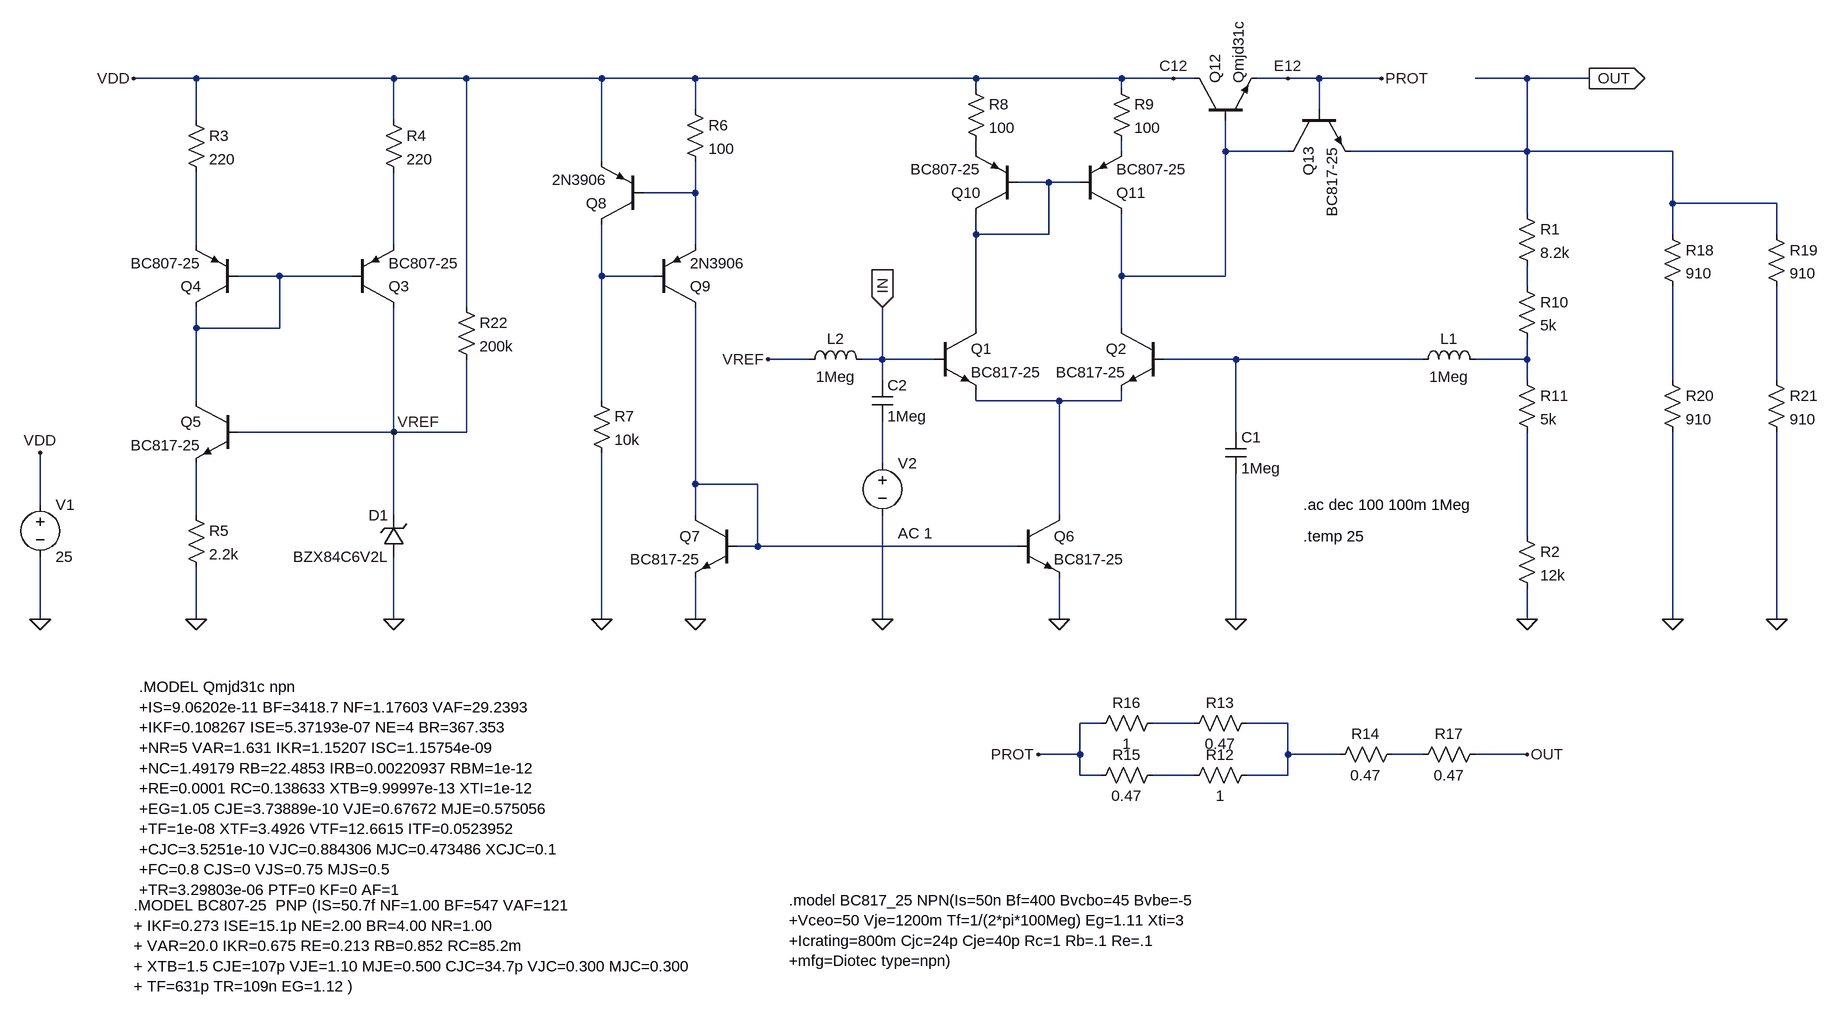
[diagram p0: schematic OPEN_LOOP.asc]
OPEN_LOOP.asc, the LTspice schematic file:
Version 4
SHEET 1 1412 880
WIRE -1088 -544 -1184 -544
WIRE -784 -544 -1088 -544
WIRE -672 -544 -784 -544
WIRE -464 -544 -672 -544
WIRE -320 -544 -464 -544
WIRE 112 -544 -320 -544
WIRE 336 -544 112 -544
WIRE 416 -544 336 -544
WIRE 448 -544 416 -544
WIRE 592 -544 544 -544
WIRE 640 -544 592 -544
WIRE 736 -544 640 -544
WIRE 960 -544 880 -544
WIRE 1056 -544 960 -544
WIRE 112 -528 112 -544
WIRE 336 -528 336 -544
WIRE -320 -496 -320 -544
WIRE 640 -496 640 -544
WIRE -1088 -480 -1088 -544
WIRE -784 -480 -784 -544
WIRE 112 -432 112 -448
WIRE 336 -432 336 -448
WIRE 496 -432 496 -480
WIRE 592 -432 496 -432
WIRE 960 -432 960 -544
WIRE 960 -432 688 -432
WIRE 1184 -432 960 -432
WIRE -464 -416 -464 -544
WIRE 224 -384 176 -384
WIRE 272 -384 224 -384
WIRE -320 -368 -320 -416
WIRE -320 -368 -400 -368
WIRE 1184 -352 1184 -432
WIRE 1344 -352 1184 -352
WIRE 960 -336 960 -432
WIRE 112 -304 112 -336
WIRE 224 -304 224 -384
WIRE 224 -304 112 -304
WIRE 1184 -304 1184 -352
WIRE 1344 -304 1344 -352
WIRE -1088 -288 -1088 -400
WIRE -784 -288 -784 -400
WIRE -320 -288 -320 -368
WIRE -960 -240 -1024 -240
WIRE -848 -240 -960 -240
WIRE -464 -240 -464 -320
WIRE -384 -240 -464 -240
WIRE 336 -240 336 -336
WIRE 496 -240 496 -432
WIRE 496 -240 336 -240
WIRE 960 -224 960 -256
WIRE -672 -192 -672 -544
WIRE -1088 -160 -1088 -192
WIRE -960 -160 -960 -240
WIRE -960 -160 -1088 -160
WIRE 112 -160 112 -304
WIRE 336 -160 336 -240
WIRE -144 -112 -208 -112
WIRE -32 -112 -32 -192
WIRE -32 -112 -64 -112
WIRE 48 -112 -32 -112
WIRE 512 -112 400 -112
WIRE 800 -112 512 -112
WIRE 960 -112 960 -144
WIRE 960 -112 880 -112
WIRE -32 -80 -32 -112
WIRE 960 -80 960 -112
WIRE 1184 -80 1184 -224
WIRE 1344 -80 1344 -224
WIRE -1088 -48 -1088 -160
WIRE -464 -48 -464 -240
WIRE 112 -48 112 -64
WIRE 240 -48 112 -48
WIRE 336 -48 336 -64
WIRE 336 -48 240 -48
WIRE -784 0 -784 -192
WIRE -784 0 -1024 0
WIRE -672 0 -672 -112
WIRE -672 0 -784 0
WIRE 512 0 512 -112
WIRE -32 48 -32 -16
WIRE -320 80 -320 -192
WIRE -224 80 -320 80
WIRE -1328 112 -1328 32
WIRE -1088 128 -1088 48
WIRE -784 128 -784 0
WIRE -320 128 -320 80
WIRE 240 128 240 -48
WIRE 960 160 960 0
WIRE -224 176 -224 80
WIRE -224 176 -256 176
WIRE 176 176 -224 176
WIRE -1328 288 -1328 192
WIRE -1088 288 -1088 208
WIRE -784 288 -784 192
WIRE -464 288 -464 32
WIRE -320 288 -320 224
WIRE -32 288 -32 128
WIRE 240 288 240 224
WIRE 512 288 512 64
WIRE 960 288 960 240
WIRE 1184 288 1184 0
WIRE 1344 288 1344 0
WIRE 304 448 272 448
WIRE 448 448 384 448
WIRE 592 448 528 448
WIRE 272 496 272 448
WIRE 272 496 208 496
WIRE 592 496 592 448
WIRE 672 496 592 496
WIRE 800 496 752 496
WIRE 960 496 880 496
WIRE 272 528 272 496
WIRE 304 528 272 528
WIRE 448 528 384 528
WIRE 592 528 592 496
WIRE 592 528 528 528
FLAG 960 288 0
FLAG -1088 288 0
FLAG 240 288 0
FLAG -320 288 0
FLAG -464 288 0
FLAG -208 -112 VREF
FLAG 1056 -544 OUT
IOPIN 1056 -544 Out
FLAG 416 -544 C12
FLAG 592 -544 E12
FLAG -1328 288 0
FLAG 736 -544 PROT
FLAG 208 496 PROT
FLAG 960 496 OUT
FLAG -1328 32 VDD
FLAG -1184 -544 VDD
FLAG -784 288 0
FLAG -784 0 VREF
FLAG 1184 288 0
FLAG 1344 288 0
FLAG 512 288 0
FLAG -32 288 0
FLAG -32 -192 IN
IOPIN -32 -192 In
SYMBOL npn 48 -160 R0
SYMATTR InstName Q1
SYMATTR Value BC817-25
SYMBOL npn 400 -160 M0
SYMATTR InstName Q2
SYMATTR Value BC817-25
SYMBOL res 944 -352 R0
SYMATTR InstName R1
SYMATTR Value 8.2k
SYMBOL res 944 144 R0
SYMATTR InstName R2
SYMATTR Value 12k
SYMBOL pnp -848 -192 M180
SYMATTR InstName Q3
SYMATTR Value BC807-25
SYMBOL pnp -1024 -192 R180
SYMATTR InstName Q4
SYMATTR Value BC807-25
SYMBOL npn -1024 -48 M0
SYMATTR InstName Q5
SYMATTR Value BC817-25
SYMBOL res -1104 -496 R0
SYMATTR InstName R3
SYMATTR Value 220
SYMBOL res -800 -496 R0
SYMATTR InstName R4
SYMATTR Value 220
SYMBOL res -1104 112 R0
SYMATTR InstName R5
SYMATTR Value 2.2k
SYMBOL npn 176 128 R0
SYMATTR InstName Q6
SYMATTR Value BC817-25
SYMBOL npn -256 128 M0
SYMATTR InstName Q7
SYMATTR Value BC817-25
SYMBOL pnp -400 -320 R180
SYMATTR InstName Q8
SYMATTR Value 2N3906
SYMBOL pnp -384 -192 M180
SYMATTR InstName Q9
SYMATTR Value 2N3906
SYMBOL res -336 -512 R0
SYMATTR InstName R6
SYMATTR Value 100
SYMBOL res -480 -64 R0
SYMATTR InstName R7
SYMATTR Value 10k
SYMBOL pnp 176 -336 R180
SYMATTR InstName Q10
SYMATTR Value BC807-25
SYMBOL pnp 272 -336 M180
SYMATTR InstName Q11
SYMATTR Value BC807-25
SYMBOL npn 448 -480 R270
SYMATTR InstName Q12
SYMATTR Value Qmjd31c
SYMBOL res 96 -544 R0
SYMATTR InstName R8
SYMATTR Value 100
SYMBOL res 320 -544 R0
SYMATTR InstName R9
SYMATTR Value 100
SYMBOL npn 592 -496 M90
SYMATTR InstName Q13
SYMATTR Value BC817-25
SYMBOL res 944 -240 R0
SYMATTR InstName R10
SYMATTR Value 5k
SYMBOL res 944 -96 R0
SYMATTR InstName R11
SYMATTR Value 5k
SYMBOL res 544 512 R90
WINDOW 0 0 56 VBottom 2
WINDOW 3 32 56 VTop 2
SYMATTR InstName R12
SYMATTR Value 1
SYMBOL res 544 432 R90
WINDOW 0 0 56 VBottom 2
WINDOW 3 32 56 VTop 2
SYMATTR InstName R13
SYMATTR Value 0.47
SYMBOL res 768 480 R90
WINDOW 0 0 56 VBottom 2
WINDOW 3 32 56 VTop 2
SYMATTR InstName R14
SYMATTR Value 0.47
SYMBOL res 400 512 R90
WINDOW 0 0 56 VBottom 2
WINDOW 3 32 56 VTop 2
SYMATTR InstName R15
SYMATTR Value 0.47
SYMBOL res 400 432 R90
WINDOW 0 0 56 VBottom 2
WINDOW 3 32 56 VTop 2
SYMATTR InstName R16
SYMATTR Value 1
SYMBOL res 896 480 R90
WINDOW 0 0 56 VBottom 2
WINDOW 3 32 56 VTop 2
SYMATTR InstName R17
SYMATTR Value 0.47
SYMBOL zener -768 192 R180
WINDOW 0 24 64 Left 2
WINDOW 3 24 0 Left 2
SYMATTR InstName D1
SYMATTR Value BZX84C6V2L
SYMBOL voltage -1328 96 R0
WINDOW 123 0 0 Left 0
WINDOW 39 0 0 Left 0
SYMATTR InstName V1
SYMATTR Value 25
SYMBOL res 1168 -320 R0
SYMATTR InstName R18
SYMATTR Value 910
SYMBOL res 1328 -320 R0
SYMATTR InstName R19
SYMATTR Value 910
SYMBOL res 1168 -96 R0
SYMATTR InstName R20
SYMATTR Value 910
SYMBOL res 1328 -96 R0
SYMATTR InstName R21
SYMATTR Value 910
SYMBOL res -688 -208 R0
SYMATTR InstName R22
SYMATTR Value 200k
SYMBOL ind 784 -96 R270
WINDOW 0 32 56 VTop 2
WINDOW 3 5 56 VBottom 2
SYMATTR InstName L1
SYMATTR Value 1Meg
SYMBOL cap 496 0 R0
SYMATTR InstName C1
SYMATTR Value 1Meg
SYMBOL cap -48 -80 R0
SYMATTR InstName C2
SYMATTR Value 1Meg
SYMBOL voltage -32 32 R0
WINDOW 123 24 124 Left 2
WINDOW 39 0 0 Left 0
SYMATTR Value2 AC 1
SYMATTR InstName V2
SYMATTR Value ""
SYMBOL ind -160 -96 R270
WINDOW 0 32 56 VTop 2
WINDOW 3 5 56 VBottom 2
SYMATTR InstName L2
SYMATTR Value 1Meg
TEXT -176 720 Left 2 !.model BC817_25 NPN(Is=50n Bf=400 Bvcbo=45 Bvbe=-5\n+Vceo=50 Vje=1200m Tf=1/(2*pi*100Meg) Eg=1.11 Xti=3\n+Icrating=800m Cjc=24p Cje=40p Rc=1 Rb=.1 Re=.1\n+mfg=Diotec type=npn)
TEXT -1176 392 Left 2 !.MODEL Qmjd31c npn\n+IS=9.06202e-11 BF=3418.7 NF=1.17603 VAF=29.2393\n+IKF=0.108267 ISE=5.37193e-07 NE=4 BR=367.353\n+NR=5 VAR=1.631 IKR=1.15207 ISC=1.15754e-09\n+NC=1.49179 RB=22.4853 IRB=0.00220937 RBM=1e-12\n+RE=0.0001 RC=0.138633 XTB=9.99997e-13 XTI=1e-12\n+EG=1.05 CJE=3.73889e-10 VJE=0.67672 MJE=0.575056\n+TF=1e-08 XTF=3.4926 VTF=12.6615 ITF=0.0523952\n+CJC=3.5251e-10 VJC=0.884306 MJC=0.473486 XCJC=0.1\n+FC=0.8 CJS=0 VJS=0.75 MJS=0.5\n+TR=3.29803e-06 PTF=0 KF=0 AF=1
TEXT -1184 728 Left 2 !.MODEL BC807-25  PNP (IS=50.7f NF=1.00 BF=547 VAF=121\n+ IKF=0.273 ISE=15.1p NE=2.00 BR=4.00 NR=1.00\n+ VAR=20.0 IKR=0.675 RE=0.213 RB=0.852 RC=85.2m\n+ XTB=1.5 CJE=107p VJE=1.10 MJE=0.500 CJC=34.7p VJC=0.300 MJC=0.300 \n+ TF=631p TR=109n EG=1.12 )
TEXT 616 160 Left 2 !.temp 25
TEXT 616 112 Left 2 !.ac dec 100 100m 1Meg

The netlist it stands for:
* OPEN_LOOP.asc
Q1 N004 IN N015 0 BC817-25
Q2 N003 N011 N015 0 BC817-25
R1 OUT N010 8.2k
R2 N019 0 12k
Q3 VREF N008 N007 0 BC807-25
Q4 N008 N008 N006 0 BC807-25
Q5 N008 VREF N018 0 BC817-25
R3 VDD N006 220
R4 VDD N007 220
R5 N018 0 2.2k
Q6 N015 N017 0 0 BC817-25
Q7 N017 N017 0 0 BC817-25
Q8 N009 N005 VDD 0 2N3906
Q9 N017 N009 N005 0 2N3906
R6 VDD N005 100
R7 N009 0 10k
Q10 N004 N004 N001 0 BC807-25
Q11 N003 N004 N002 0 BC807-25
Q12 VDD N003 PROT 0 Qmjd31c
R8 VDD N001 100
R9 VDD N002 100
Q13 N003 PROT OUT 0 BC817-25
R10 N010 N012 5k
R11 N012 N019 5k
R12 N021 N023 1
R13 N021 N020 0.47
R14 N022 N021 0.47
R15 N023 PROT 0.47
R16 N020 PROT 1
R17 OUT N022 0.47
D1 0 VREF BZX84C6V2L
V1 VDD 0 25
R18 OUT N013 910
R19 OUT N014 910
R20 N013 0 910
R21 N014 0 910
R22 VDD VREF 200k
L1 N011 N012 1Meg
C1 N011 0 1Meg
C2 IN N016 1Meg
V2 N016 0 AC 1
L2 VREF IN 1Meg
.model D D
.lib standard.dio
.model NPN NPN
.model PNP PNP
.lib standard.bjt
.model BC817_25 NPN(Is=50n Bf=400 Bvcbo=45 Bvbe=-5
+Vceo=50 Vje=1200m Tf=1/(2*pi*100Meg) Eg=1.11 Xti=3
+Icrating=800m Cjc=24p Cje=40p Rc=1 Rb=.1 Re=.1
+mfg=Diotec type=npn)
.MODEL Qmjd31c npn
+IS=9.06202e-11 BF=3418.7 NF=1.17603 VAF=29.2393
+IKF=0.108267 ISE=5.37193e-07 NE=4 BR=367.353
+NR=5 VAR=1.631 IKR=1.15207 ISC=1.15754e-09
+NC=1.49179 RB=22.4853 IRB=0.00220937 RBM=1e-12
+RE=0.0001 RC=0.138633 XTB=9.99997e-13 XTI=1e-12
+EG=1.05 CJE=3.73889e-10 VJE=0.67672 MJE=0.575056
+TF=1e-08 XTF=3.4926 VTF=12.6615 ITF=0.0523952
+CJC=3.5251e-10 VJC=0.884306 MJC=0.473486 XCJC=0.1
+FC=0.8 CJS=0 VJS=0.75 MJS=0.5
+TR=3.29803e-06 PTF=0 KF=0 AF=1
.MODEL BC807-25  PNP (IS=50.7f NF=1.00 BF=547 VAF=121
+ IKF=0.273 ISE=15.1p NE=2.00 BR=4.00 NR=1.00
+ VAR=20.0 IKR=0.675 RE=0.213 RB=0.852 RC=85.2m
+ XTB=1.5 CJE=107p VJE=1.10 MJE=0.500 CJC=34.7p VJC=0.300 MJC=0.300
+ TF=631p TR=109n EG=1.12 )
.temp 25
.ac dec 100 100m 1Meg
.backanno
.end